# Altium project AVR_RCS.PrjPcb
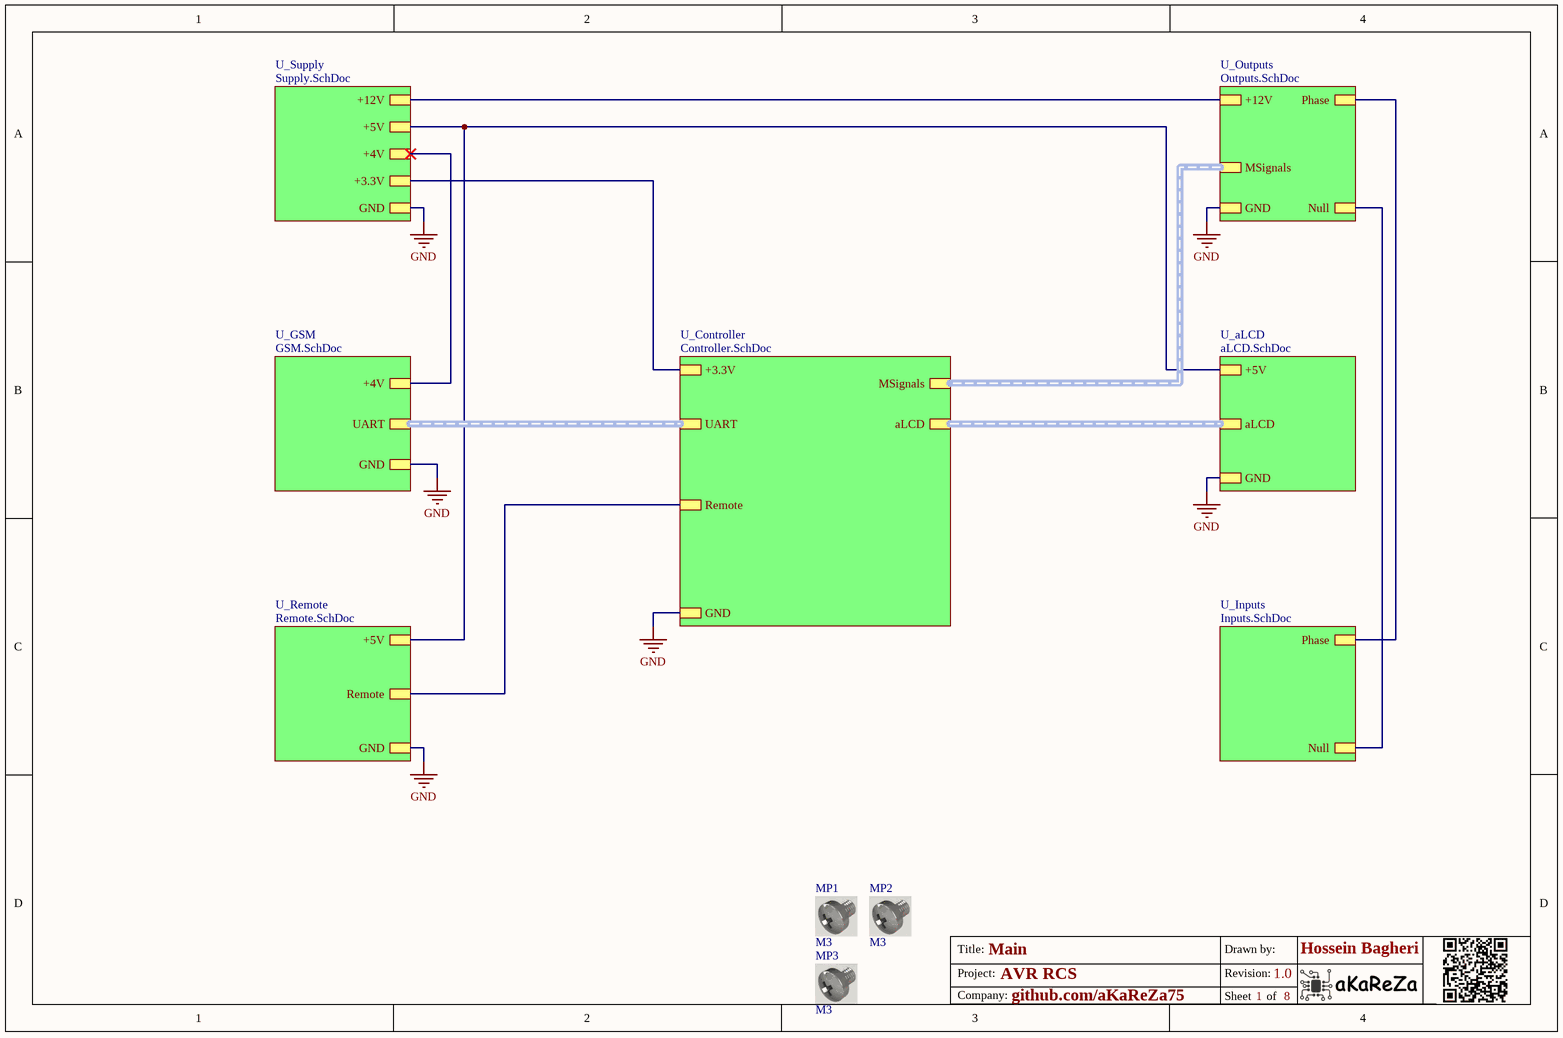
[diagram p0: Main.SchDoc]
CompanyName: github.com/aKaReZa75; Project_Name: AVR RCS; Revision: 1.0
8 sheets, 115 parts. Net scope: strictly hierarchical (ports join the sheet entries above them; power ports are local).
Board file: PCB.PcbDoc
Sheets:
  Main.SchDoc
    U_aLCD = aLCD.SchDoc
    U_Controller = Controller.SchDoc
    U_GSM = GSM.SchDoc
    U_Inputs = Inputs.SchDoc
    U_Outputs = Outputs.SchDoc
    U_Remote = Remote.SchDoc
    U_Supply = Supply.SchDoc

## Sheet Main.SchDoc: Main
size A4; SheetNumber: 1; SheetTotal: 8

### Parts
MP1  M3  [SCREW-M3]
MP2  M3  [SCREW-M3]
MP3  M3  [SCREW-M3]

### Sub-sheets
U_aLCD = aLCD.SchDoc: +5V, GND, aLCD (harness aLCD)
U_Controller = Controller.SchDoc: +3.3V, GND, aLCD (harness aLCD), MSignals (harness MotorSignals), UART (harness UART), Remote
U_GSM = GSM.SchDoc: +4V, GND, UART (harness UART)
U_Inputs = Inputs.SchDoc: Phase, Null
U_Outputs = Outputs.SchDoc: +12V, Phase, Null, GND, MSignals (harness MotorSignals)
U_Remote = Remote.SchDoc: +5V, GND, Remote
U_Supply = Supply.SchDoc: +12V, +5V, +3.3V, +4V, GND

### Nets
+3.3: sheet U_Controller/+3.3V, sheet U_Supply/+3.3V
+4: sheet U_GSM/+4V, sheet U_Supply/+4V
+5: sheet U_aLCD/+5V, sheet U_Remote/+5V, sheet U_Supply/+5V
+12: sheet U_Outputs/+12V, sheet U_Supply/+12V
GND: sheet U_aLCD/GND, sheet U_Controller/GND, sheet U_GSM/GND, sheet U_Outputs/GND, sheet U_Remote/GND, sheet U_Supply/GND
Null: sheet U_Inputs/Null, sheet U_Outputs/Null
Phase: sheet U_Inputs/Phase, sheet U_Outputs/Phase
Remote: sheet U_Controller/Remote, sheet U_Remote/Remote

### Buses and harness runs
harness sheet U_aLCD/aLCD = sheet U_Controller/aLCD
harness sheet U_Controller/MSignals = sheet U_Outputs/MSignals
harness sheet U_Controller/UART = sheet U_GSM/UART

### Notes on the sheet
- Title:
- Project:
- Drawn by:
- Revision:
- Hossein Bagheri
- Company:
- Sheet
- of

### Library data of the parts
MP1-MP3 = Other_Mech_Screw: Board Screw With Spacer; Rating: Rating?; Inflow: 8243; Validation: Valid; Package: Package?; Type: Screw; Value: M3

## Sheet aLCD.SchDoc: aLCD
size A4; SheetNumber: 7; SheetTotal: 8
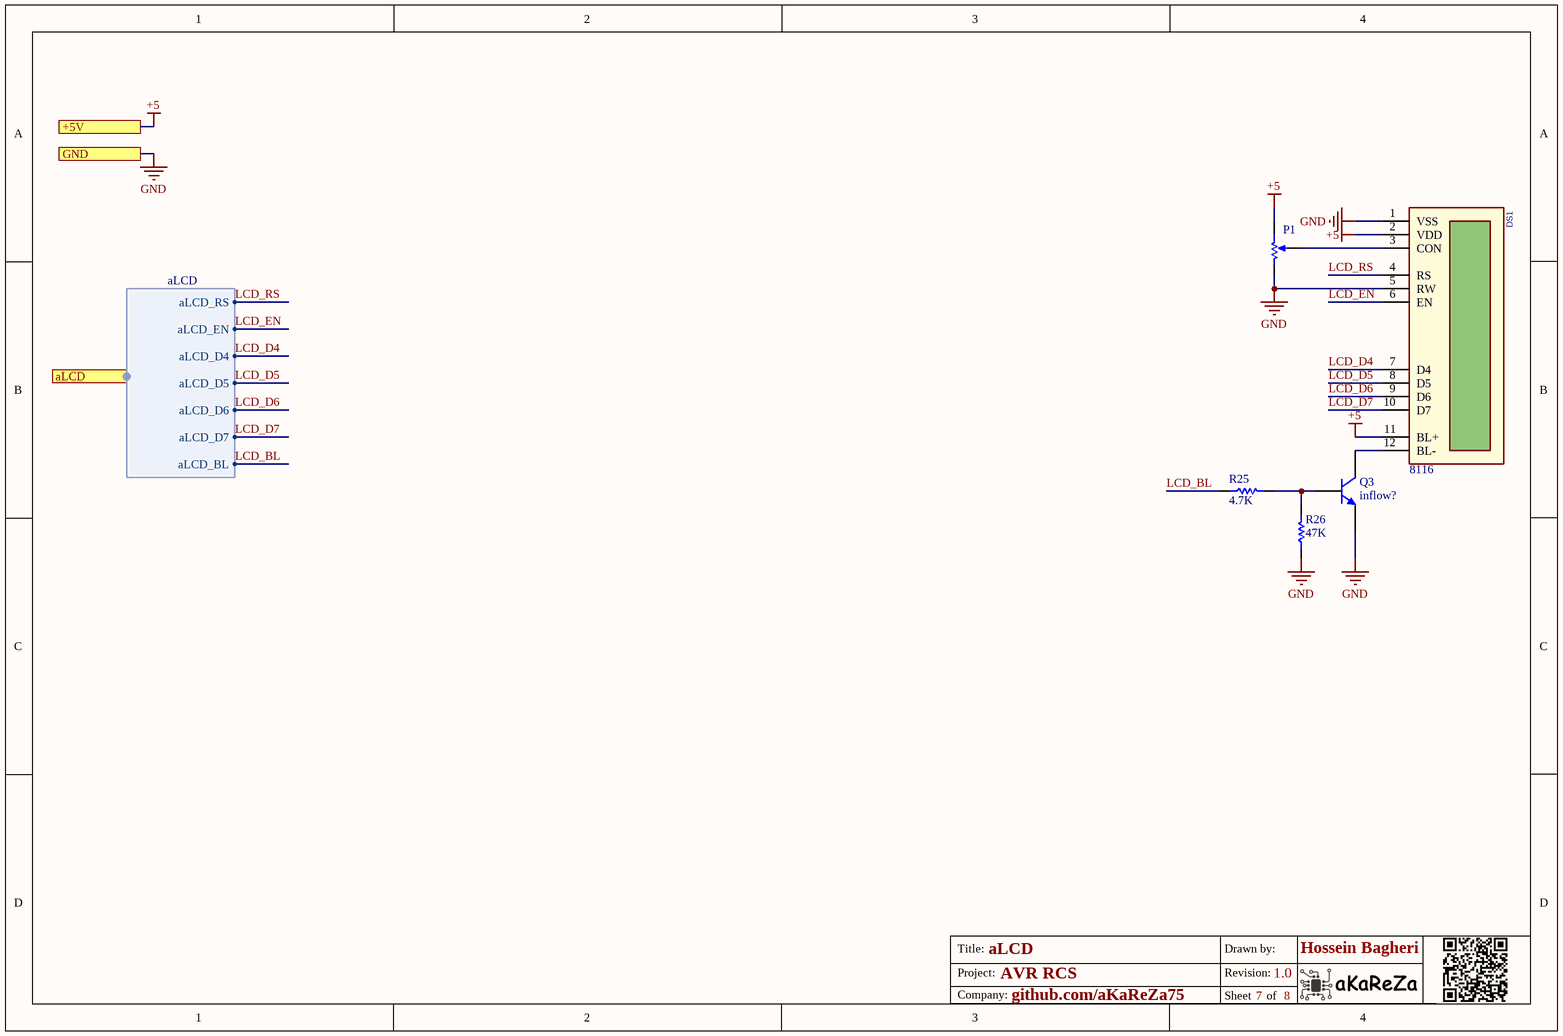
[diagram p1: aLCD.SchDoc]

### Parts
DS1  Inflow: 8116  [BOX-HDR-2x6-2.54mm-S]  (hidden comment: 16x2)
P1  10K  [Multi turn 01]  (value not drawn)
Q3  Inflow: inflow?  [SOT23_N]  (hidden comment: NPN)
R25  4.7K  [RES 0805 (2012X06L)]
R26  47K  [RES 0805 (2012X06L)]

### Ports
+5V, aLCD (harness aLCD), GND

### Harnesses
aLCD: aLCD_RS, aLCD_EN, aLCD_D4, aLCD_D5, aLCD_D6, aLCD_D7, aLCD_BL

### Nets
+5: DS1.2(VDD) DS1.11(BL+) P1.1 ; port +5V
GND: DS1.1(VSS) DS1.5(RW) P1.3 Q3.2(E) R26.1 ; port GND
LCD_BL: R25.1 ; port aLCD.aLCD_BL
LCD_D4: DS1.7(D4) ; port aLCD.aLCD_D4
LCD_D5: DS1.8(D5) ; port aLCD.aLCD_D5
LCD_D6: DS1.9(D6) ; port aLCD.aLCD_D6
LCD_D7: DS1.10(D7) ; port aLCD.aLCD_D7
LCD_EN: DS1.6(EN) ; port aLCD.aLCD_EN
LCD_RS: DS1.4(RS) ; port aLCD.aLCD_RS
NetDS1_3: DS1.3(CON) P1.2
NetDS1_12: DS1.12(BL-) Q3.3(C)
NetQ3_1: Q3.1(B) R25.2 R26.2

### Notes on the sheet
- Title:
- Project:
- Drawn by:
- Revision:
- Hossein Bagheri
- Company:
- Sheet
- of

### Library data of the parts
DS1 = ModSen_LCD_CH_16x2_Box: Alphanumeric LCD character; Rating: Rating?; Validation: Valid; Value: 16x2; Package: Dip; Type: Alphanumeric
P1 = Res_Multi: Multi Turn; Rating: Rating?; Validation: Valid; Inflow: inflow?; Package: Package?; Type: Type?; Value: 10K
Q3 = Semi_BJT_BC817: NPN General purpose Transistor; Rating: Rating?; Type: Type?; Validation: Valid; Value: NPN; Package: Package?
R25 R26 = Res_SMD_0805: Resistor; Inflow: inflow?; Rating: 0.125W; Validation: Valid; Package: 0805; Type: 10%
  R25: Value: 4.7K
  R26: Value: 47K

## Sheet Controller.SchDoc: Controller
size A4; SheetNumber: 3; SheetTotal: 8
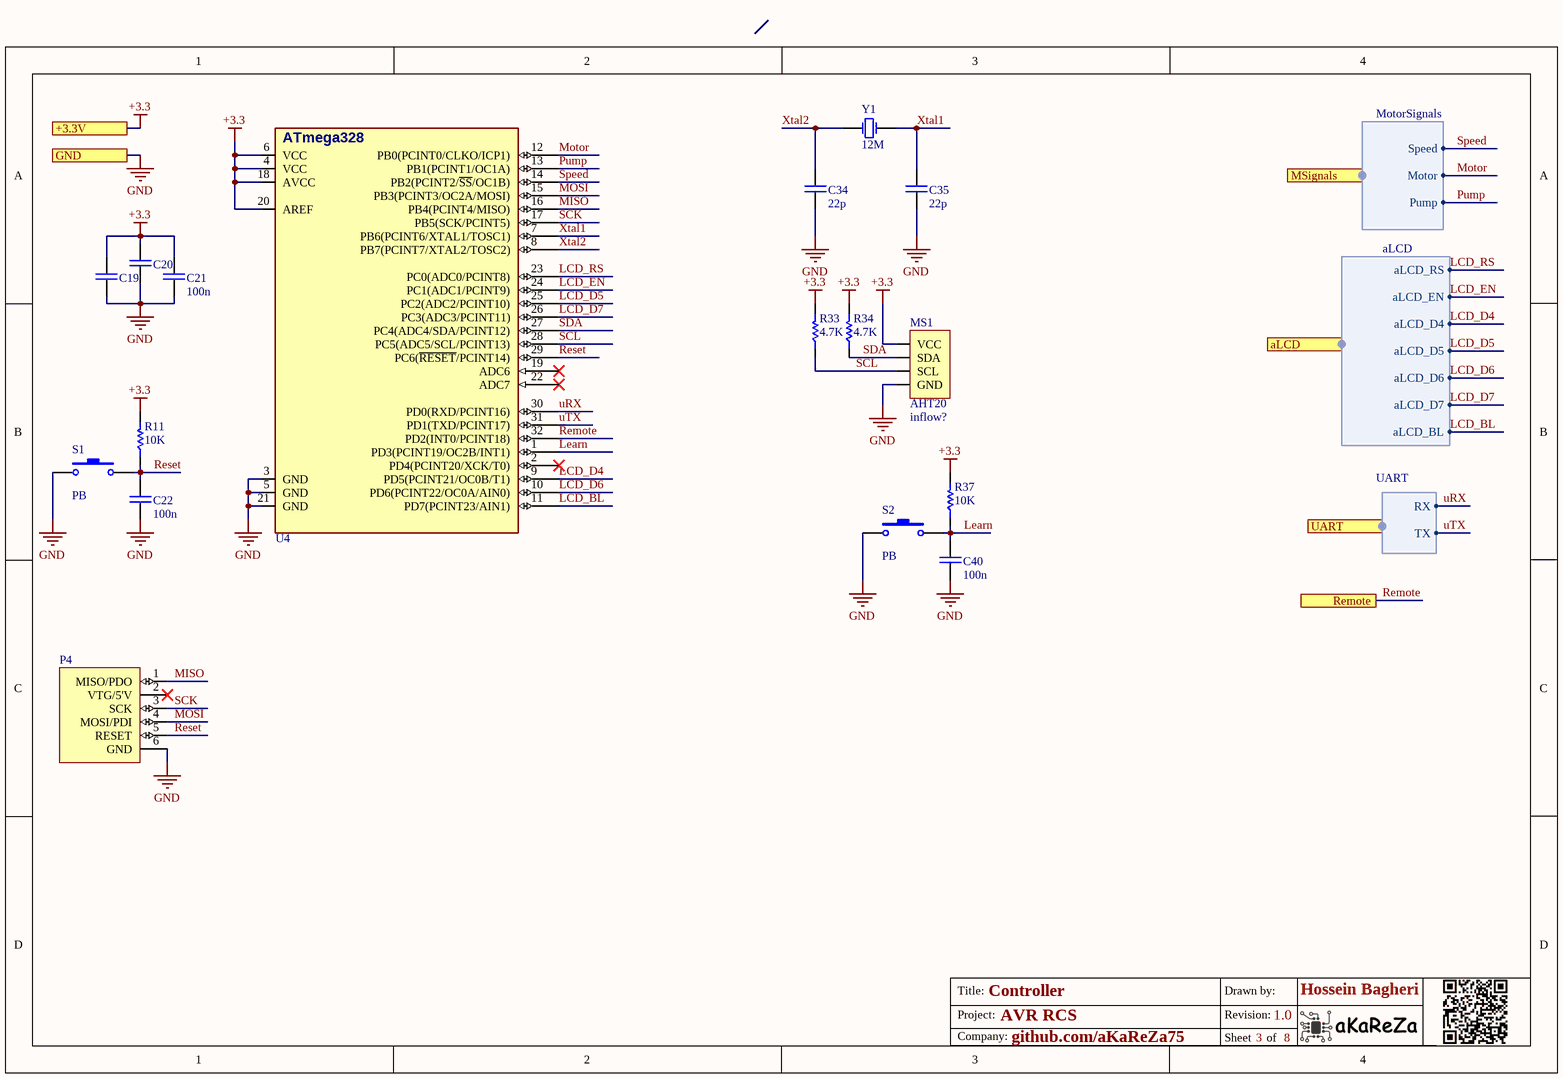
[diagram p2: Controller.SchDoc]

### Parts
C19  100n  [CAP 0805/2012]  (value not drawn)
C20  100n  [CAP 0805/2012]  (value not drawn)
C21  100n  [CAP 0805/2012]
C22  100n  [CAP 0805/2012]
C34  22p  [CAP 0805/2012]
C35  22p  [CAP 0805/2012]
C40  100n  [CAP 0805/2012]
MS1  Inflow: inflow?  [AHT20]  (hidden comment: AHT20)
P4  3x2  [IDC_2X3]  (value not drawn)
R11  10K  [RES 0805 (2012X06L)]
R33  4.7K  [RES 0805 (2012X06L)]
R34  4.7K  [RES 0805 (2012X06L)]
R37  10K  [RES 0805 (2012X06L)]
S1  PB  [SW_PB_SMD_2PIN_SPST_6X3X2]
S2  PB  [SW_PB_SMD_2PIN_SPST_6X3X2]
U4  ATmega328P  [ATMEGA328]  (value not drawn)
Y1  12M  [Crystal SMD]

### Ports
+3.3V, aLCD (harness aLCD), GND, MSignals (harness MotorSignals), Remote, UART (harness UART)

### Harnesses
MotorSignals: Speed, Motor, Pump
UART: RX, TX
aLCD: aLCD_RS, aLCD_EN, aLCD_D4, aLCD_D5, aLCD_D6, aLCD_D7, aLCD_BL

### Nets
+3.3: C19.1 C20.1 C21.1 MS1.4(VCC) R11.2 R33.2 R34.2 R37.2 U4.4(VCC) U4.6(VCC) U4.18(AVCC) U4.20(AREF) ; port +3.3V
GND: C19.2 C20.2 C21.2 C22.2 C34.2 C35.2 C40.2 MS1.3(GND) P4.6(GND) S1.1 S2.1 U4.3(GND) U4.5(GND) U4.21(GND) ; port GND
LCD_BL: U4.11(PD7(PCINT23/AIN1)) ; port aLCD.aLCD_BL
LCD_D4: U4.9(PD5(PCINT21/OC0B/T1)) ; port aLCD.aLCD_D4
LCD_D5: U4.25(PC2(ADC2/PCINT10)) ; port aLCD.aLCD_D5
LCD_D6: U4.10(PD6(PCINT22/OC0A/AIN0)) ; port aLCD.aLCD_D6
LCD_D7: U4.26(PC3(ADC3/PCINT11)) ; port aLCD.aLCD_D7
LCD_EN: U4.24(PC1(ADC1/PCINT9)) ; port aLCD.aLCD_EN
LCD_RS: U4.23(PC0(ADC0/PCINT8)) ; port aLCD.aLCD_RS
Learn: C40.1 R37.1 S2.2 U4.1(PD3(PCINT19/OC2B/INT1))
MISO: P4.1(MISO/PDO) U4.16(PB4(PCINT4/MISO))
MOSI: P4.4(MOSI/PDI) U4.15(PB3(PCINT3/OC2A/MOSI))
Motor: U4.12(PB0(PCINT0/CLKO/ICP1)) ; port MSignals.Motor
Pump: U4.13(PB1(PCINT1/OC1A)) ; port MSignals.Pump
Remote: U4.32(PD2(INT0/PCINT18)) ; port Remote
Reset: C22.1 P4.5(RESET) R11.1 S1.2 U4.29(PC6(~{RESET}/PCINT14))
SCK: P4.3(SCK) U4.17(PB5(SCK/PCINT5))
SCL: MS1.2(SCL) R33.1 U4.28(PC5(ADC5/SCL/PCINT13))
SDA: MS1.1(SDA) R34.1 U4.27(PC4(ADC4/SDA/PCINT12))
Speed: U4.14(PB2(PCINT2/~{SS}/OC1B)) ; port MSignals.Speed
uRX: U4.30(PD0(RXD/PCINT16)) ; port UART.RX
uTX: U4.31(PD1(TXD/PCINT17)) ; port UART.TX
Xtal1: C35.1 U4.7(PB6(PCINT6/XTAL1/TOSC1)) Y1.2(OSC2)
Xtal2: C34.1 U4.8(PB7(PCINT7/XTAL2/TOSC2)) Y1.1(OSC1)

Not connected (* = marked no-connect by the designer): P4 2(VTG/5'V)*; U4 2(PD4(PCINT20/XCK/T0))* 19(ADC6)* 22(ADC7)*

### Notes on the sheet
- Title:
- Project:
- Drawn by:
- Revision:
- Hossein Bagheri
- Company:
- Sheet
- of
- (in symbol IC_MCU_ATmega328P_SMD) ATmega328

### Library data of the parts
C19-C22 C40 = Cap_Multi_SMD_100nF_0805: Bipolar ceramic capacitor SMD; Inflow: inflow?; Type: MultiLayer; Rating: 50V; Validation: Valid; Package: 0805; Value: 100n
C34 C35 = Cap_Multi_SMD_0805: Bipolar ceramic capacitor SMD; Inflow: inflow?; Type: MultiLayer; Rating: Rating?; Validation: Valid; Package: 0805; Value: 22p
MS1 = ModSen_AHT20: Air Temperature and Humidity Sensor; Rating: Rating?; Validation: NT; Package: Dip; Type: Air T&H; Value: AHT20
P4 = Con_Prog_MKII_ISP: 6 Pin Standard ISP Header For MKII; Rating: Rating?; Validation: NT; Inflow: inflow?; Value: 3x2; Package: Package?; Type: Type?
R11 R33 R34 R37 = Res_SMD_0805: as R25 on sheet aLCD; Package: 0805; Type: 10%
  R11 R37: Value: 10K
  R33 R34: Value: 4.7K
S1 S2 = SW_PushButton_2_SMD: SMT Tactile ‎Switch; Rating: 2b; Validation: Valid; Inflow: 8260; Type: Vertical; Package: SMD; Value: PB
U4 = IC_MCU_ATmega328P_SMD: 8-Bit AVR Microcontroller with 32K Bytes of In-System Programmable Flash Memory; Rating: Rating?; Validation: Valid; Inflow: inflow?; Value: ATmega328P; Package: Package?; Type: Type?
Y1 = Other_Elec_Xtal_SMD: Crystal Oscillator; Rating: Rating?; Inflow: inflow?; Validation: Valid; Package: SMD; Type: Quartz; Value: 12M

## Sheet GSM.SchDoc: GSM
size A4; SheetNumber: 6; SheetTotal: 8
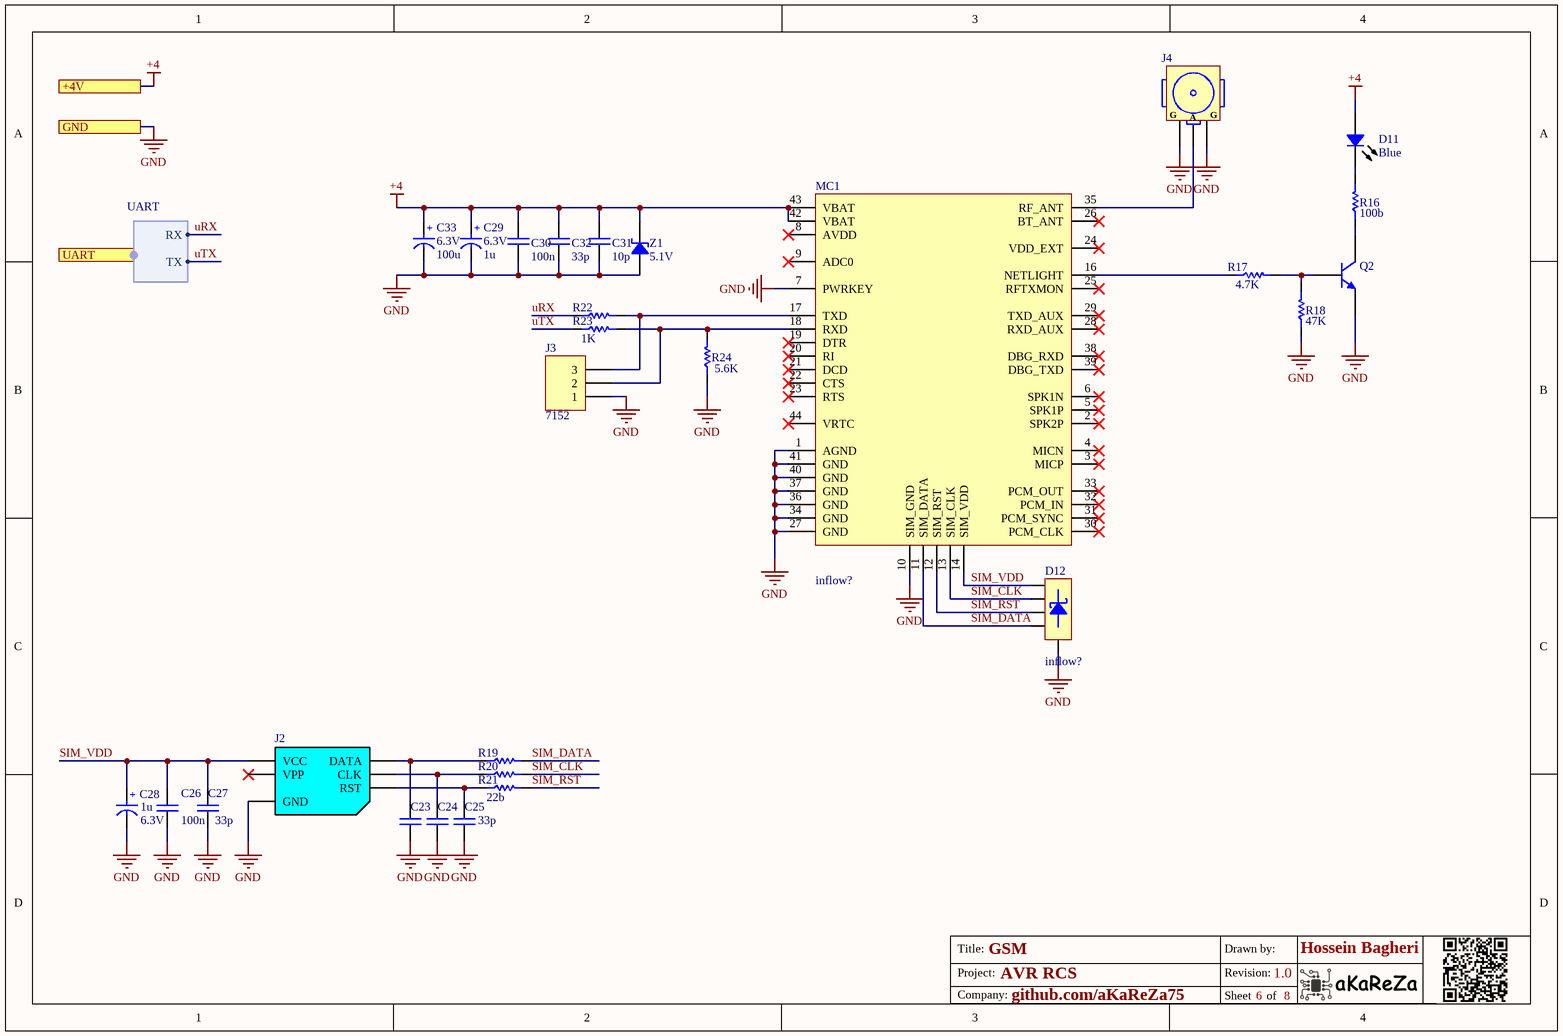
[diagram p3: GSM.SchDoc]

### Parts
C23  33p  [CAP 0805/2012]  (value not drawn)
C24  33p  [CAP 0805/2012]  (value not drawn)
C25  33p  [CAP 0805/2012]
C26  100n  [CAP 0805/2012]
C27  33p  [CAP 0805/2012]
C28  Rating: 6.3V  [SMT_C_Tantalum_A]  (hidden comment: 1u)
C29  Rating: 6.3V  [SMT_C_Tantalum_A]  (hidden comment: 1u)
C30  100n  [CAP 1206/3216]
C31  10p  [CAP 1206/3216]
C32  33p  [CAP 1206/3216]
C33  Rating: 6.3V  [SMT_C_Tantalum_C]  (hidden comment: 100u)
D11  Blue  [LED 0805/2012 BLUE]
D12  Inflow: inflow?  [SC70-5_N]  (hidden comment: SMF-05)
J2  6'Pin  [GCT_SIM8051_Plastik]  (value not drawn)
J3  Inflow: 7152  [HDR_THT_3M_2.54mm]  (hidden comment: 3)
J4  U.FL  [IPEX-3x3mm]  (value not drawn)
MC1  Inflow: inflow?  [m66]  (hidden comment: M66)
Q2  NPN  [SOT23_N]  (value not drawn)
R16  100b  [RES 0805 (2012X06L)]
R17  4.7K  [RES 0805 (2012X06L)]
R18  47K  [RES 0805 (2012X06L)]
R19  22b  [RES 0805 (2012X06L)]  (value not drawn)
R20  22b  [RES 0805 (2012X06L)]  (value not drawn)
R21  22b  [RES 0805 (2012X06L)]
R22  1K  [RES 0805 (2012X06L)]  (value not drawn)
R23  1K  [RES 0805 (2012X06L)]
R24  5.6K  [RES 0805 (2012X06L)]
Z1  5.1V  [SOD80, LL-34]

### Ports
+4V, GND, UART (harness UART)

### Harnesses
UART: RX, TX

### Nets
+4: C29.1(+) C30.1 C31.1 C32.1 C33.1(+) D11.1 MC1.42(VBAT) MC1.43(VBAT) Z1.2 ; port +4V
GND: C23.2 C24.2 C25.2 C26.2 C27.2 C28.2(-) C29.2(-) C30.2 C31.2 C32.2 C33.2(-) D12.2(K) J2.5(GND) J3.1 J4.2(G) J4.3(G) MC1.1(AGND) MC1.7(PWRKEY) MC1.10(SIM_GND) MC1.27(GND) MC1.34(GND) MC1.36(GND) MC1.37(GND) MC1.40(GND) MC1.41(GND) Q2.2(E) R18.1 R24.1 Z1.1 ; port GND
SIM_CLK: D12.3(K) MC1.13(SIM_CLK) R20.2
SIM_DATA: D12.5(K) MC1.11(SIM_DATA) R19.2
SIM_RST: D12.4(K) MC1.12(SIM_RST) R21.2
SIM_VDD: C26.1 C27.1 C28.1(+) D12.1(K) J2.1(VCC) MC1.14(SIM_VDD)
uRX: R22.1 ; port UART.RX
uTX: R23.1 ; port UART.TX
NetC23_1: C23.1 J2.4(DATA) R19.1
NetC24_1: C24.1 J2.3(CLK) R20.1
NetC25_1: C25.1 J2.2(RST) R21.1
NetD11_2: D11.2 R16.2
NetJ3_2: J3.2 MC1.18(RXD) R23.2 R24.2
NetJ3_3: J3.3 MC1.17(TXD) R22.2
NetJ4_1: J4.1(A) MC1.35(RF_ANT)
NetMC1_16: MC1.16(NETLIGHT) R17.1
NetQ2_1: Q2.1(B) R17.2 R18.2
NetQ2_3: Q2.3(C) R16.1

Not connected (* = marked no-connect by the designer): J2 6(VPP)*; MC1 2(SPK2P)* 3(MICP)* 4(MICN)* 5(SPK1P)* 6(SPK1N)* 8(AVDD)* 9(ADC0)* 19(DTR)* 20(RI)* 21(DCD)* 22(CTS)* 23(RTS)* 24(VDD_EXT)* 25(RFTXMON)* 26(BT_ANT)* 28(RXD_AUX)* 29(TXD_AUX)* 30(PCM_CLK)* 31(PCM_SYNC)* 32(PCM_IN)* 33(PCM_OUT)* 38(DBG_RXD)* 39(DBG_TXD)* 44(VRTC)*

### Notes on the sheet
- Title:
- Project:
- Drawn by:
- Revision:
- Hossein Bagheri
- Company:
- Sheet
- of

### Library data of the parts
C23-C25 C27 = Cap_Multi_SMD_0805: Bipolar ceramic capacitor SMD; Inflow: inflow?; Type: MultiLayer; Rating: Rating?; Package: 0805; Value: 33p
C26 = Cap_Multi_SMD_100nF_0805: Bipolar ceramic capacitor SMD; Inflow: inflow?; Type: MultiLayer; Rating: 50V; Package: 0805; Value: 100n
C28 C29 C33 = Cap_Tantalum: Tantalum Capacitor,TAJ Series-SMD; Inflow: inflow?; Type: Tantalum
  C28 C29: Package: SMD-A; Value: 1u
  C33: Package: SMD-C; Value: 100u
C30 = Cap_Multi_SMD_100nF_1206: Bipolar ceramic capacitor SMD; Type: MultiLayer; Inflow: inflow?; Rating: 50V; Package: 1206; Value: 100n
C31 C32 = Cap_Multi_SMD_1206: Bipolar ceramic capacitor SMD; Inflow: inflow?; Type: MultiLayer; Rating: 50V; Package: 1206
  C31: Value: 10p
  C32: Value: 33p
D11 = Semi_LED_SMD: LED; Inflow: inflow?; Rating: Rating?; Validation: Valid; Package: Package?; Type: LED; Value: Blue
D12 = Semi_Diod_TVS_SMF05: TVS Diode Array; Rating: Rating?; Validation: Valid; Type: TVS; Value: SMF-05; Package: SC70-5
J2 = Con_Socket_SimCard_1: Nano SimCard Holder 6P; Rating: Rating?; Validation: Valid; Inflow: inflow?; Package: SMD; Type: Nano; Value: 6'Pin
J3 = Con_MPH_3x1_V_THT_2.54: Header, single row, 3 pin; Rating: Rating?; Validation: NT; Value: 3; Package: Package?; Type: Type?
J4 = Con_RF_U.FL: Rating: Rating?; Inflow: inflow?; Type: RF; Package: SMD; Value: U.FL
MC1 = ModSen_Com_M66: Quectel GSM/GPRS Module; Rating: Rating?; Validation: Valid; Package: Dip; Value: M66; Type: GSM-GPRS
Q2 = Semi_BJT_BC817: NPN General purpose Transistor; Rating: Rating?; Type: Type?; Validation: Valid; Inflow: inflow?; Value: NPN; Package: Package?
R16-R24 = Res_SMD_0805: Resistor; Inflow: inflow?; Rating: 0.125W; Package: 0805; Type: 10%
  R16: Value: 100b
  R17: Value: 4.7K
  R18: Value: 47K
  R19-R21: Value: 22b
  R22 R23: Value: 1K
  R24: Value: 5.6K
Z1 = Semi_Diod_Zener_SMD: Zener Diode; Rating: 0.5W; Inflow: inflow?; Type: Zener; Value: 5.1V; Package: SOD-80

## Sheet Inputs.SchDoc: Inputs
size A4; SheetNumber: 5; SheetTotal: 8
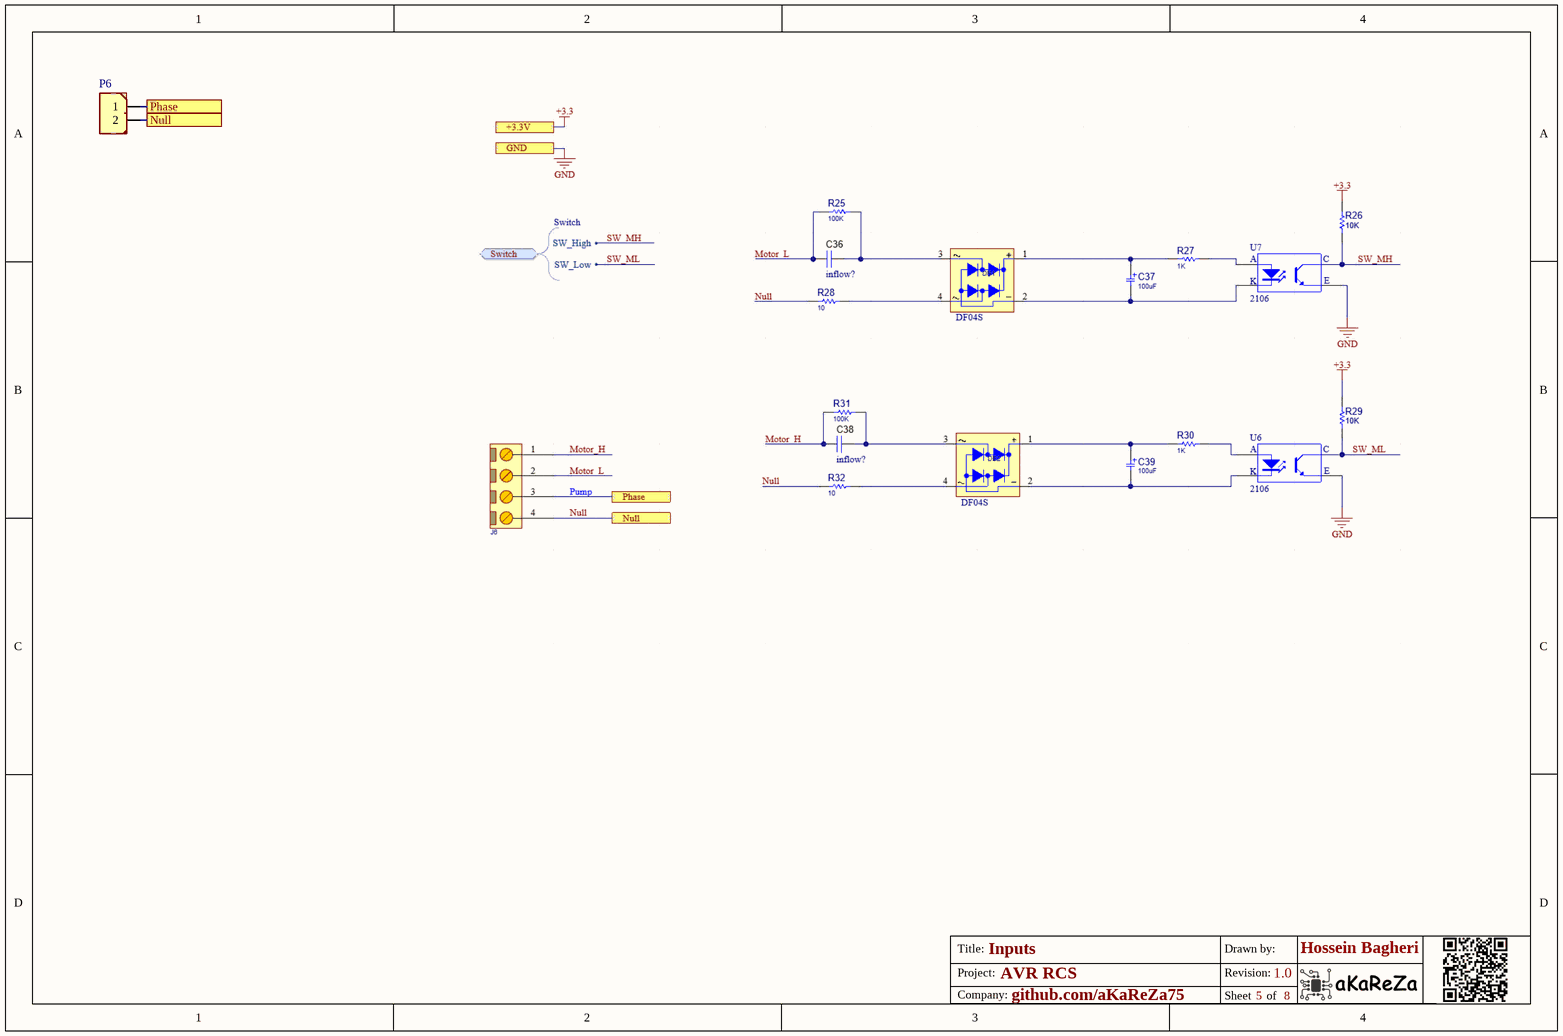
[diagram p4: Inputs.SchDoc]

### Parts
P6  2'Pin  [Phoenix_2PIN_RA_P5.08mm]  (value not drawn)

### Ports
Null, Phase

### Nets
Null: P6.2 ; port Null
Phase: P6.1 ; port Phase

### Notes on the sheet
- Title:
- Project:
- Drawn by:
- Revision:
- Hossein Bagheri
- Company:
- Sheet
- of

### Library data of the parts
P6 = Con_Power_2: Power Connector 2'Pin; Rating: Rating?; Validation: NT; Inflow: inflow?; Value: 2'Pin; Package: Package?; Type: Type?

## Sheet Outputs.SchDoc: Outputs
size A4; SheetNumber: 4; SheetTotal: 8
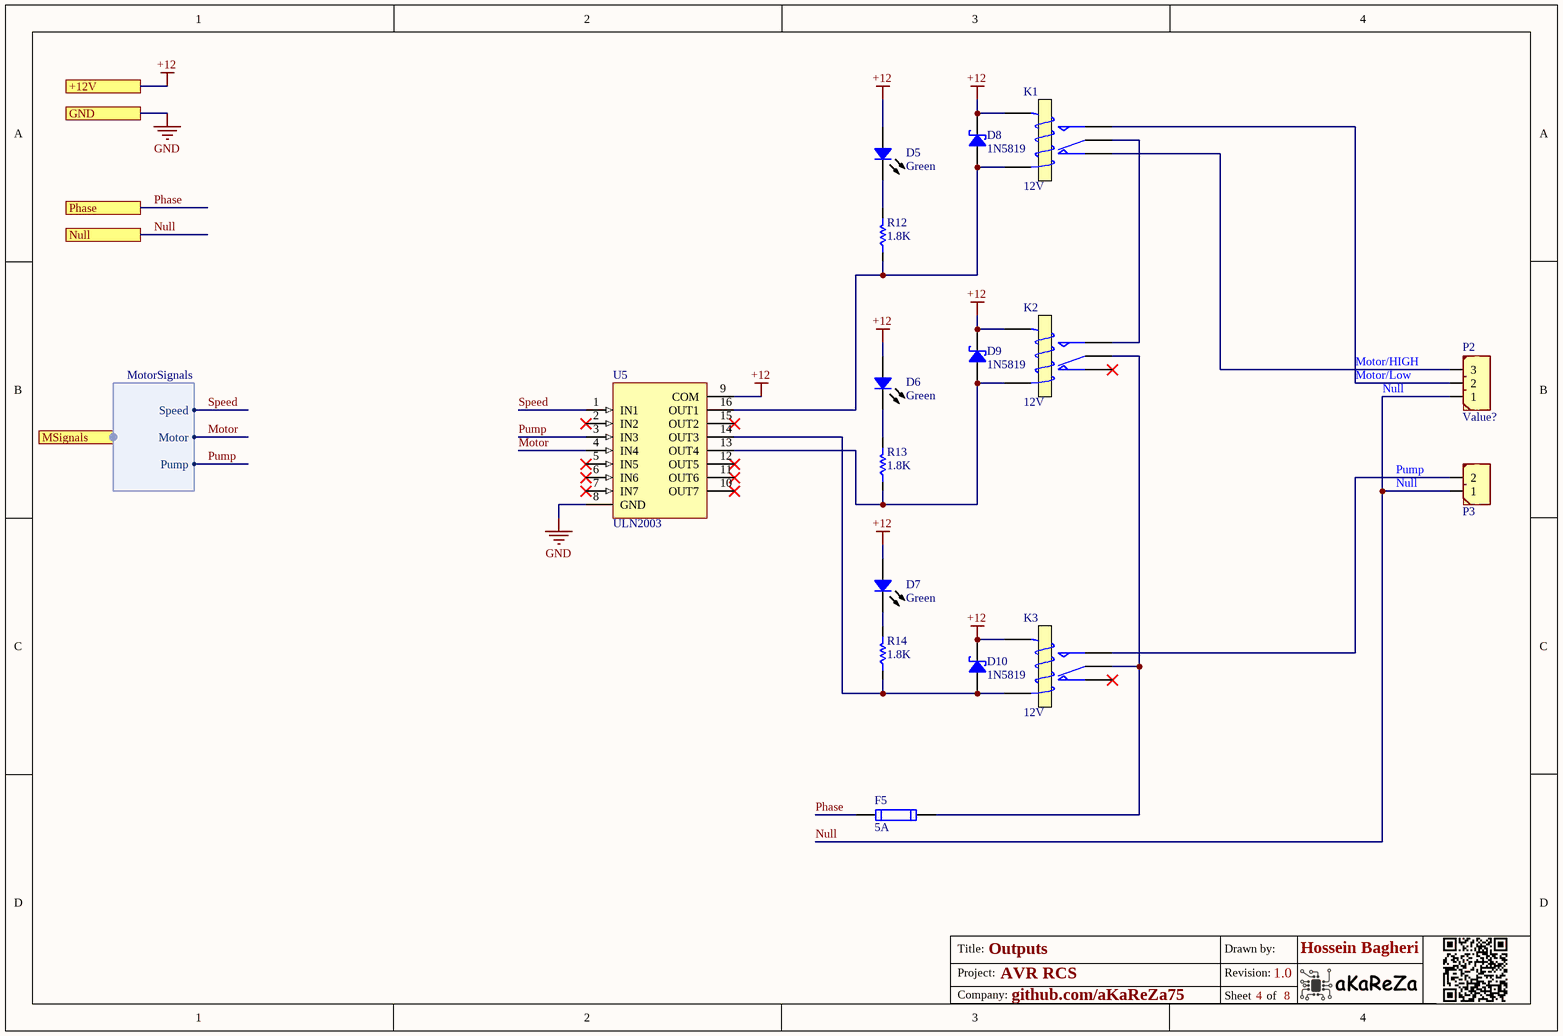
[diagram p5: Outputs.SchDoc]

### Parts
D5  Green  [LED 0805/2012 GREEN]
D6  Green  [LED 0805/2012 GREEN]
D7  Green  [LED 0805/2012 GREEN]
D8  1N5819  [430X270D]
D9  1N5819  [430X270D]
D10  1N5819  [430X270D]
F5  5A  [FUSE_BLX_20x5]
K1  12V  [Relay 18.85x15.35x15.70]
K2  12V  [Relay 18.85x15.35x15.70]
K3  12V  [Relay 18.85x15.35x15.70]
P2  Value?  [Phoenix_3PIN_RA_P5.08mm]
P3  2'Pin  [Phoenix_2PIN_RA_P5.08mm]  (value not drawn)
R12  1.8K  [RES 0805 (2012X06L)]
R13  1.8K  [RES 0805 (2012X06L)]
R14  1.8K  [RES 0805 (2012X06L)]
U5  ULN2003  [SO16_M]

### Ports
+12V, GND, MSignals (harness MotorSignals), Null, Phase

### Harnesses
MotorSignals: Speed, Motor, Pump

### Nets
+12: D5.1 D6.1 D7.1 D8.2 D9.2 D10.2 K1.5(T2) K2.5(T2) K3.5(T2) U5.9(COM) ; port +12V
GND: U5.8(GND) ; port GND
Motor: U5.4(IN4) ; port MSignals.Motor
Null: P2.1 P3.1 ; port Null
Phase: F5.1 ; port Phase
Pump: U5.3(IN3) ; port MSignals.Pump
Speed: U5.1(IN1) ; port MSignals.Speed
NetD5_2: D5.2 R12.2
NetD6_2: D6.2 R13.2
NetD7_2: D7.2 R14.2
NetD8_1: D8.1 K1.4(T1) R12.1 U5.16(OUT1)
NetD9_1: D9.1 K2.4(T1) R13.1 U5.13(OUT4)
NetD10_1: D10.1 K3.4(T1) R14.1 U5.14(OUT3)
NetF5_2: F5.2 K2.1(COM) K3.1(COM)
NetK1_1: K1.1(COM) K2.3(NO)
NetK1_2: K1.2(NC) P2.3
NetK1_3: K1.3(NO) P2.2
NetK3_3: K3.3(NO) P3.2

Not connected (* = marked no-connect by the designer): K2 2(NC)*; K3 2(NC)*; U5 2(IN2)* 5(IN5)* 6(IN6)* 7(IN7)* 10(OUT7)* 11(OUT6)* 12(OUT5)* 15(OUT2)*

### Notes on the sheet
- (near P2) Motor/Low
- (near P2) Motor/HIGH
- Null
- (near P3) Null
- (near P3) Pump
- Title:
- Project:
- Drawn by:
- Revision:
- Hossein Bagheri
- Company:
- Sheet
- of

### Library data of the parts
D5-D7 = Semi_LED_SMD: as D11 on sheet GSM; Package: Package?; Type: LED; Value: Green
D8-D10 = Semi_Diod_Sch_1N5819_SMD: Schottky Rectifiers; Rating: Rating?; Validation: Valid; Inflow: inflow?; Package: SMA; Type: Schottky; Value: 1N5819
F5 = Other_Elec_Fuse_THT: Short circiut  protection; Type: Type?; Inflow: inflow?; Rating: Rating?; Validation: Valid; Package: Package?; Value: 5A
K1-K3 = SW_Relay_SPDT: SPDT Relay; Rating: Rating?; Validation: Valid; Inflow: inflow?; Type: SPDT; Package: Dip; Value: 12V
P2 = Con_Power_3: Power Connector 3'Pin; Rating: 3b; Inflow: inflow?; Validation: Valid; Package: Dip; Type: Type?; Value: Value?
P3 = Con_Power_2: as P6 on sheet Inputs; Value: 2'Pin; Package: Package?; Type: Type?
R12-R14 = Res_SMD_0805: as R25 on sheet aLCD; Package: 0805; Type: 10%; Value: 1.8K
U5 = IC_Driver_ULN2003: Seven darlington array drivers; Rating: Rating?; Validation: Valid; Inflow: 1506; Package: SO-16; Type: Driver; Value: ULN2003

## Sheet Remote.SchDoc: Remote
size A4; SheetNumber: 8; SheetTotal: 8
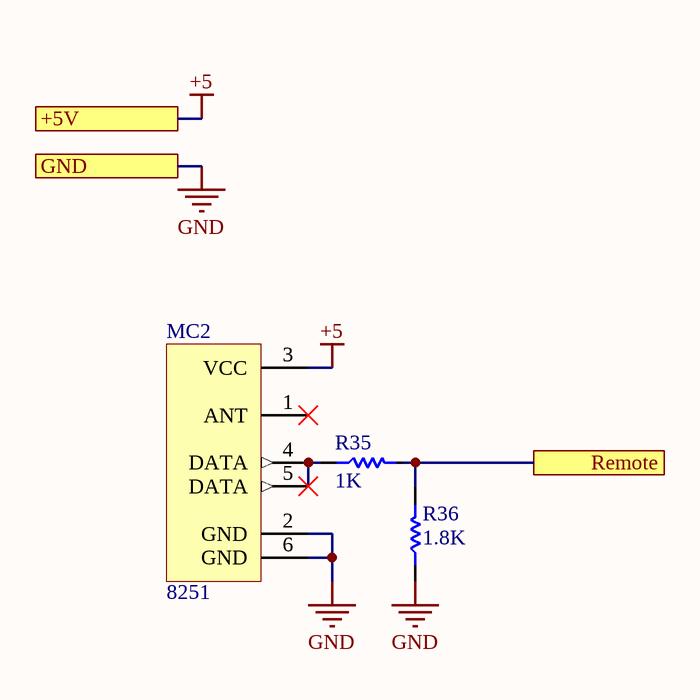
[diagram p6: Remote.SchDoc]

### Parts
MC2  Inflow: 8251  [RF_ETRXB]  (hidden comment: RXB22)
R35  1K  [RES 0805 (2012X06L)]
R36  1.8K  [RES 0805 (2012X06L)]

### Ports
+5V, GND, Remote

### Nets
+5: MC2.3(VCC) ; port +5V
GND: MC2.2(GND) MC2.6(GND) R36.1 ; port GND
Remote: R35.2 R36.2 ; port Remote
NetMC2_4: MC2.4(DATA) MC2.5(DATA) R35.1

Not connected (* = marked no-connect by the designer): MC2 1(ANT)*

### Notes on the sheet
- Title:
- Project:
- Drawn by:
- Revision:
- Hossein Bagheri
- Company:
- Sheet
- of

### Library data of the parts
MC2 = ModSen_Com_RXB22_433: JMR RXB22 433MHz ASK superheterodyne wireless receiving module; Rating: 433M; Validation: NT; Value: RXB22; Package: Dip; Type: Learning
R35 R36 = Res_SMD_0805: as R25 on sheet aLCD; Package: 0805; Type: 10%
  R35: Value: 1K
  R36: Value: 1.8K

## Sheet Supply.SchDoc: Supply
size A4; SheetNumber: 2; SheetTotal: 8
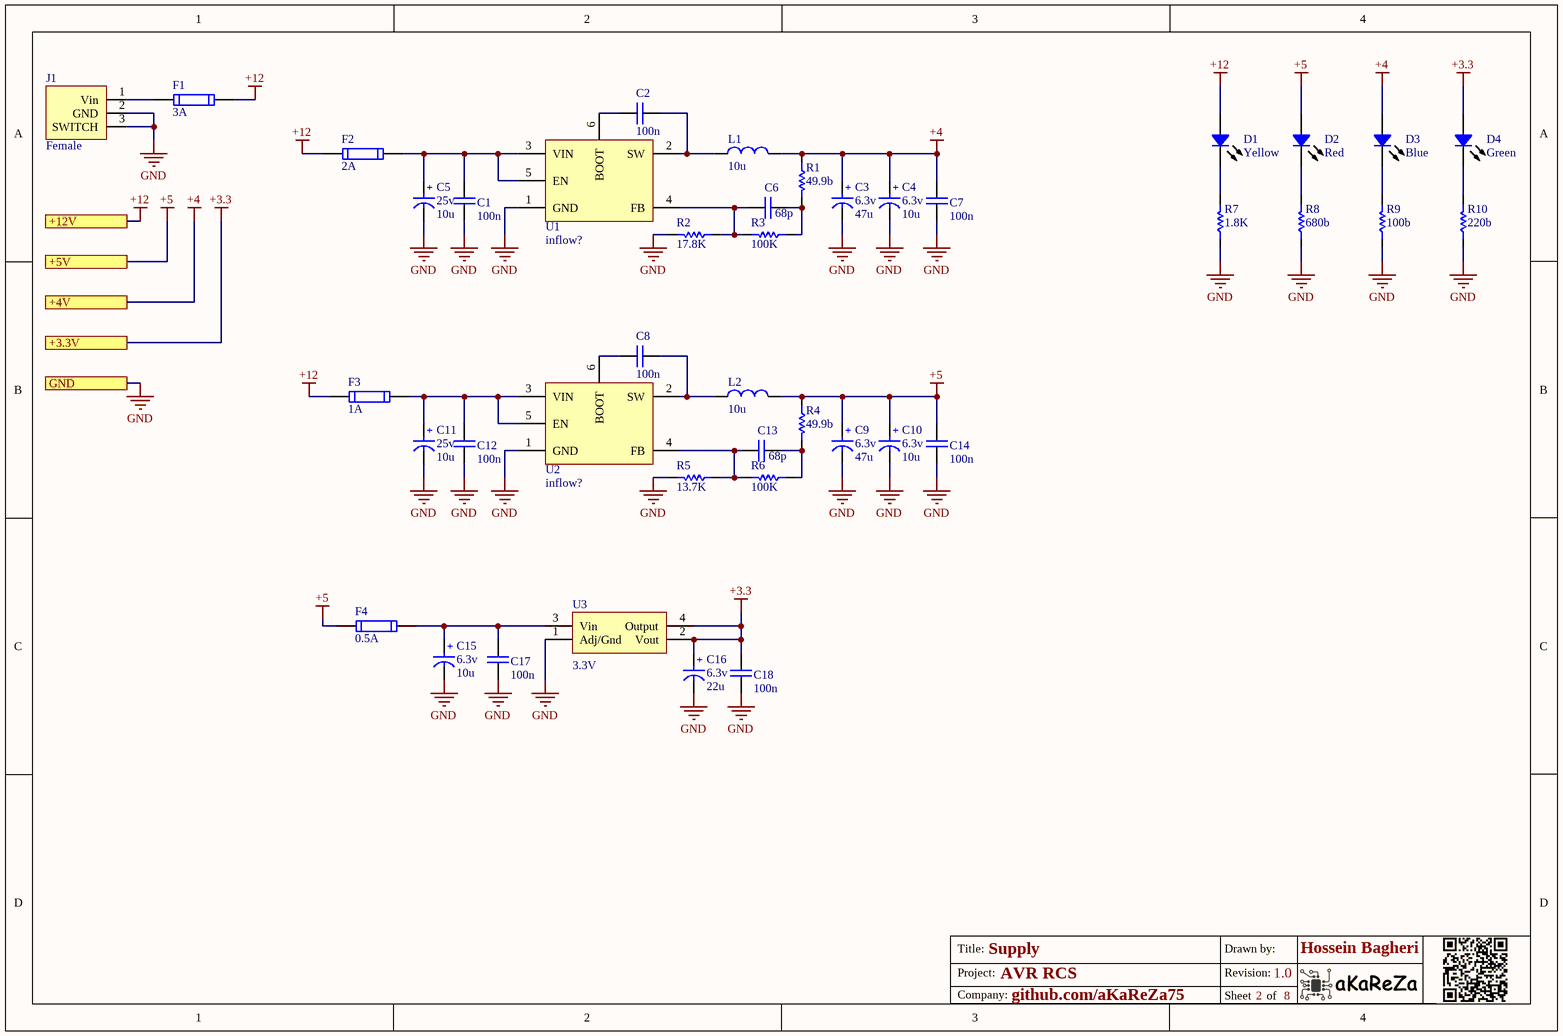
[diagram p7: Supply.SchDoc]

### Parts
C1  100n  [CAP 1206/3216]
C2  100n  [CAP 0805/2012]
C3  Rating: 6.3v  [SMT_C_Tantalum_B]  (hidden comment: 47u)
C4  Rating: 6.3v  [SMT_C_Tantalum_A]  (hidden comment: 10u)
C5  Rating: 25v  [SMT_C_Tantalum_B]  (hidden comment: 10u)
C6  68p  [CAP 0805/2012]
C7  100n  [CAP 1206/3216]
C8  100n  [CAP 0805/2012]
C9  Rating: 6.3v  [SMT_C_Tantalum_B]  (hidden comment: 47u)
C10  Rating: 6.3v  [SMT_C_Tantalum_A]  (hidden comment: 10u)
C11  Rating: 25v  [SMT_C_Tantalum_B]  (hidden comment: 10u)
C12  100n  [CAP 1206/3216]
C13  68p  [CAP 0805/2012]
C14  100n  [CAP 1206/3216]
C15  Rating: 6.3v  [SMT_C_Tantalum_A]  (hidden comment: 10u)
C16  Rating: 6.3v  [SMT_C_Tantalum_A]  (hidden comment: 22u)
C17  100n  [CAP 1206/3216]
C18  100n  [CAP 1206/3216]
D1  Yellow  [LED 0805/2012 YELLOW]
D2  Red  [LED 0805/2012 RED]
D3  Blue  [LED 0805/2012 BLUE]
D4  Green  [LED 0805/2012 GREEN]
F1  3A  [1206_F]
F2  2A  [1206_F]
F3  1A  [1206_F]
F4  0.5A  [1206_F]
J1  Female  [Power Jack BIG]
L1  10u  [L_7]
L2  10u  [L_7]
R1  49.9b  [RES 0805 (2012X06L)]
R2  17.8K  [RES 0805 (2012X06L)]
R3  100K  [RES 0805 (2012X06L)]
R4  49.9b  [RES 0805 (2012X06L)]
R5  13.7K  [RES 0805 (2012X06L)]
R6  100K  [RES 0805 (2012X06L)]
R7  1.8K  [RES 0805 (2012X06L)]
R8  680b  [RES 0805 (2012X06L)]
R9  100b  [RES 0805 (2012X06L)]
R10  220b  [RES 0805 (2012X06L)]
U1  Inflow: inflow?  [TPS54302]  (hidden comment: Value?)
U2  Inflow: inflow?  [TPS54302]  (hidden comment: Value?)
U3  3.3V  [SOT223_M]

### Ports
+3.3V, +4V, +5V, +12V, GND

### Nets
+3.3: C16.1(+) C18.1 D4.1 U3.2(Vout) U3.4(Output) ; port +3.3V
+4: C3.1(+) C4.1(+) C7.1 D3.1 L1.2 R1.1 ; port +4V
+5: C9.1(+) C10.1(+) C14.1 D2.1 F4.1 L2.2 R4.1 ; port +5V
+12: D1.1 F1.2 F2.1 F3.1 ; port +12V
GND: C1.2 C3.2(-) C4.2(-) C5.2(-) C7.2 C9.2(-) C10.2(-) C11.2(-) C12.2 C14.2 C15.2(-) C16.2(-) C17.2 C18.2 J1.2(GND) J1.3(SWITCH) R2.2 R5.2 R7.1 R8.1 R9.1 R10.1 U1.1(GND) U2.1(GND) U3.1(Adj/Gnd) ; port GND
NetC1_1: C1.1 C5.1(+) F2.2 U1.3(VIN) U1.5(EN)
NetC2_1: C2.1 U1.6(BOOT)
NetC2_2: C2.2 L1.1 U1.2(SW)
NetC6_1: C6.1 R2.1 R3.2 U1.4(FB)
NetC6_2: C6.2 R1.2 R3.1
NetC8_1: C8.1 U2.6(BOOT)
NetC8_2: C8.2 L2.1 U2.2(SW)
NetC11_1: C11.1(+) C12.1 F3.2 U2.3(VIN) U2.5(EN)
NetC13_1: C13.1 R5.1 R6.2 U2.4(FB)
NetC13_2: C13.2 R4.2 R6.1
NetC15_1: C15.1(+) C17.1 F4.2 U3.3(Vin)
NetD1_2: D1.2 R7.2
NetD2_2: D2.2 R8.2
NetD3_2: D3.2 R9.2
NetD4_2: D4.2 R10.2
NetF1_1: F1.1 J1.1(Vin)

### Notes on the sheet
- Title:
- Project:
- Drawn by:
- Revision:
- Hossein Bagheri
- Company:
- Sheet
- of

### Library data of the parts
C1 C7 C12 C14 C17 C18 = Cap_Multi_SMD_100nF_1206: Bipolar ceramic capacitor SMD; Type: MultiLayer; Inflow: inflow?; Rating: 50V; Validation: Valid; Package: 1206; Value: 100n
C2 C8 = Cap_Multi_SMD_100nF_0805: as C19 on sheet Controller; Package: 0805; Value: 100n
C3-C5 C9-C11 C15 C16 = Cap_Tantalum: Tantalum Capacitor,TAJ Series-SMD; Inflow: inflow?; Validation: Valid; Package: Package?; Type: Tantalum
  C3 C9: Value: 47u
  C4 C5 C10 C11 C15: Value: 10u
  C16: Value: 22u
C6 C13 = Cap_Multi_SMD_0805: as C34 on sheet Controller; Package: 0805; Value: 68p
D1-D4 = Semi_LED_SMD: as D11 on sheet GSM; Package: Package?; Type: LED
  D1: Value: Yellow
  D2: Value: Red
  D3: Value: Blue
  D4: Value: Green
F1-F4 = Other_Elec_Fuse_SMD: Short circiut  protection; Inflow: inflow?; Type: Fast; Rating: Rating?; Validation: Valid; Package: 1206
  F1: Value: 3A
  F2: Value: 2A
  F3: Value: 1A
  F4: Value: 0.5A
J1 = Con_Power_Jack: Power Jack; Rating: Rating?; Validation: Valid; Inflow: 6127; Type: Type?; Package: Package?; Value: Female
L1 L2 = Ind_SMD: Inductor; Inflow: inflow?; Type: Type?; Rating: 3.8A; Validation: Valid; Package: Package?; Value: 10u
R1-R10 = Res_SMD_0805: as R25 on sheet aLCD; Package: 0805
  R1 R4: Type: 1%; Value: 49.9b
  R2: Type: 1%; Value: 17.8K
  R3 R6: Type: 1%; Value: 100K
  R5: Type: 1%; Value: 13.7K
  R7: Type: 10%; Value: 1.8K
  R8: Type: 10%; Value: 680b
  R9: Type: 10%; Value: 100b
  R10: Type: 10%; Value: 220b
U1 U2 = IC_Reg_TPS54302: 3'A Synchronous Step-Down Converter; Rating: S; Validation: Valid; Value: Value?; Type: Switching; Package: SOT-23-6
U3 = IC_Reg_AMS1117_3.3: 1'A Positive voltage regulator; Rating: 1A; Validation: Valid; Inflow: 5217; Type: LDO; Package: SOT223; Value: 3.3V

## Nets that join several sheets
+3.3: Controller (12 pins), Supply (5 pins)
+4: GSM (9 pins), Supply (6 pins)
+5: aLCD (DS1.2 DS1.11 P1.1), Remote (MC2.3), Supply (7 pins)
+12: Outputs (10 pins), Supply (D1.1 F1.2 F2.1 F3.1)
GND: aLCD (5 pins), Controller (14 pins), GSM (29 pins), Outputs (U5.8), Remote (MC2.2 MC2.6 R36.1), Supply (25 pins)
LCD_BL: aLCD (R25.1), Controller (U4.11)
LCD_D4: aLCD (DS1.7), Controller (U4.9)
LCD_D5: aLCD (DS1.8), Controller (U4.25)
LCD_D6: aLCD (DS1.9), Controller (U4.10)
LCD_D7: aLCD (DS1.10), Controller (U4.26)
LCD_EN: aLCD (DS1.6), Controller (U4.24)
LCD_RS: aLCD (DS1.4), Controller (U4.23)
Motor: Controller (U4.12), Outputs (U5.4)
Null: Inputs (P6.2), Outputs (P2.1 P3.1)
Phase: Inputs (P6.1), Outputs (F5.1)
Pump: Controller (U4.13), Outputs (U5.3)
Remote: Controller (U4.32), Remote (R35.2 R36.2)
Speed: Controller (U4.14), Outputs (U5.1)
uRX: Controller (U4.30), GSM (R22.1)
uTX: Controller (U4.31), GSM (R23.1)